# EAGLE design working (EAGLE 6.5.0)
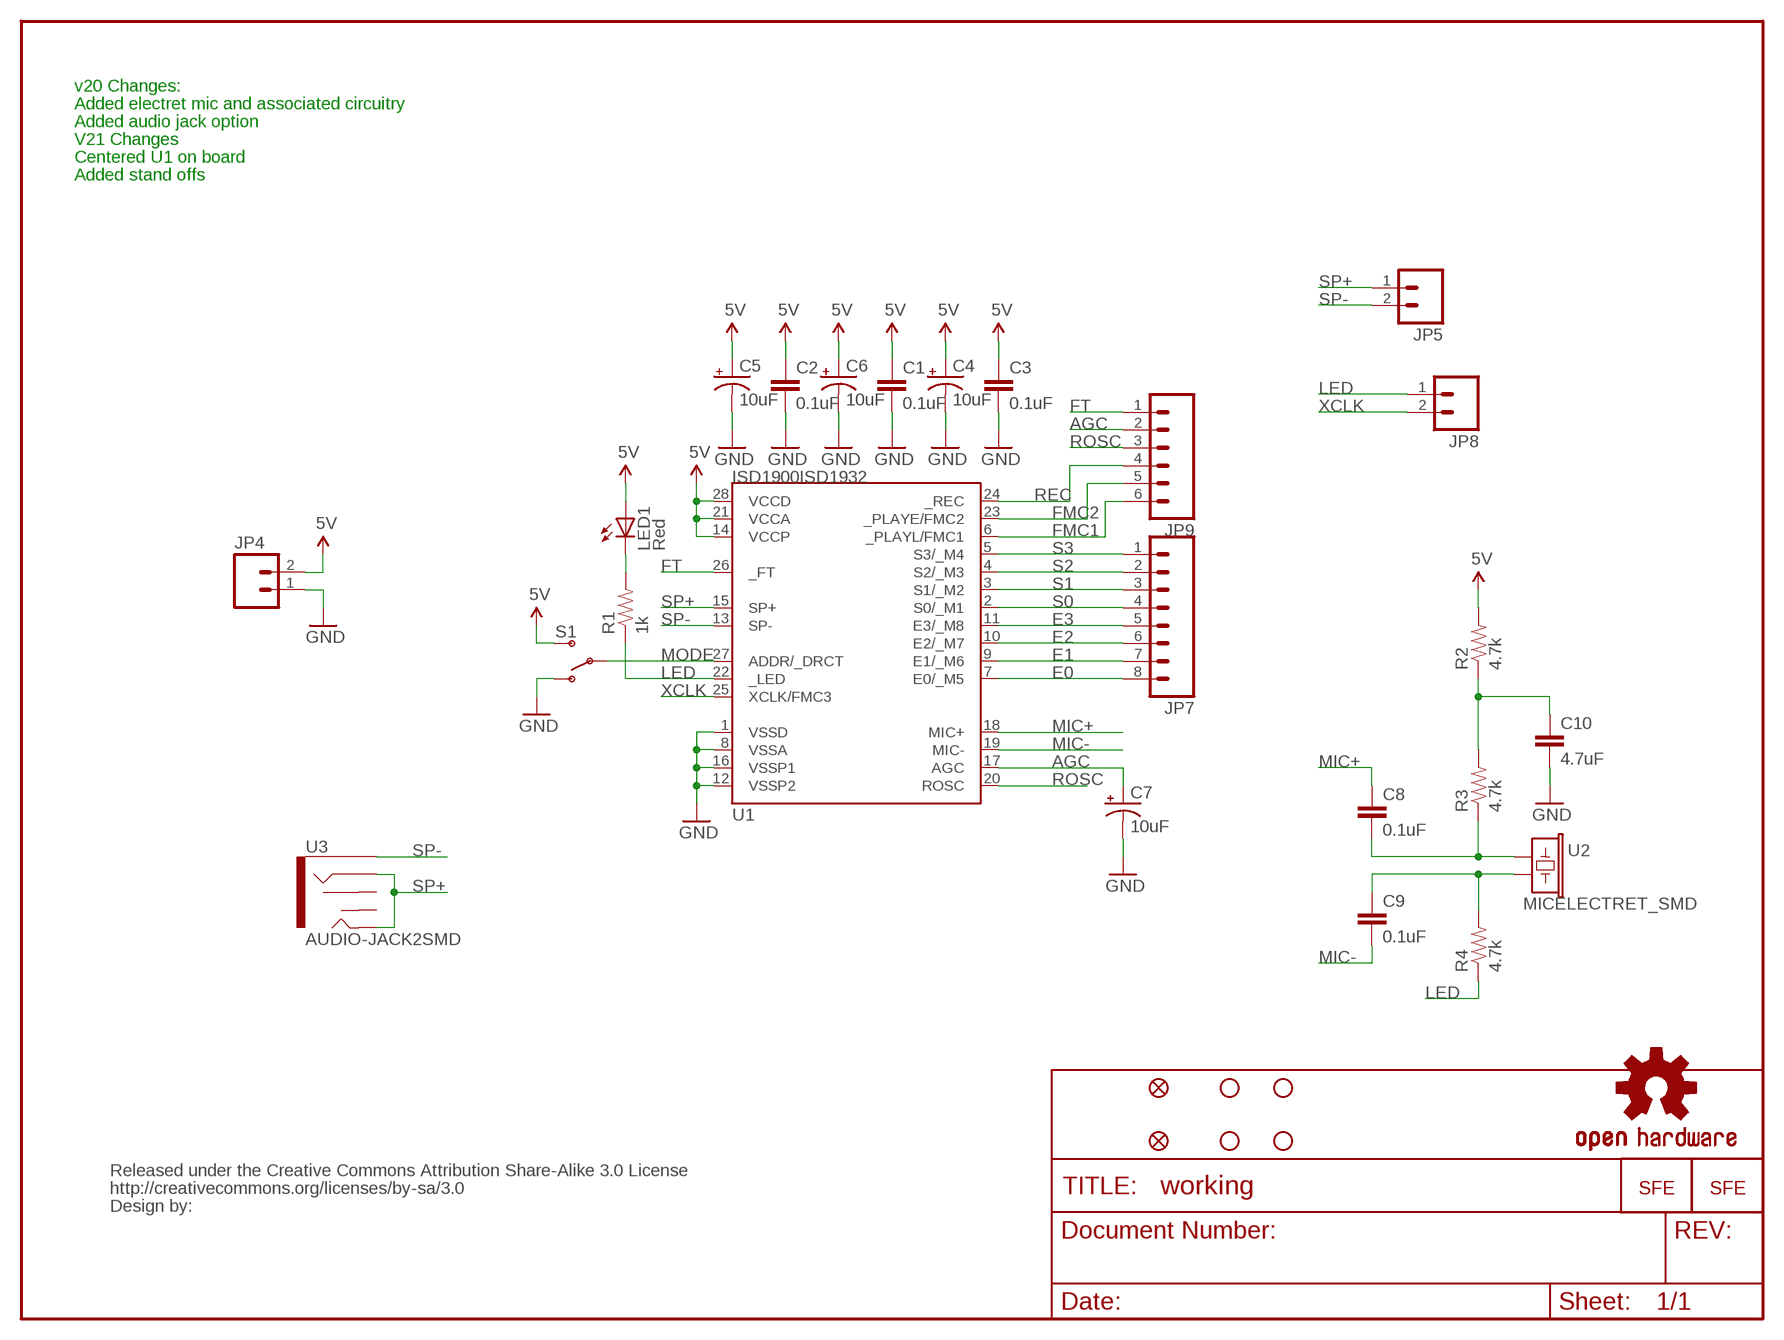
[diagram p0: schematic, sheet 1]

## Parts
C1  0.1uF  CAP0603-CAP  [0603-CAP]
C2  0.1uF  CAP0603-CAP  [0603-CAP]
C3  0.1uF  CAP0603-CAP  [0603-CAP]
C4  10uF  CAP_POL1206  [EIA3216]
C5  10uF  CAP_POL1206  [EIA3216]
C6  10uF  CAP_POL1206  [EIA3216]
C7  10uF  CAP_POL1206  [EIA3216]
C8  0.1uF  CAP0603-CAP  [0603-CAP]
C9  0.1uF  CAP0603-CAP  [0603-CAP]
C10  4.7uF  CAP0603-CAP  [0603-CAP]
JP1  LOGO-SFENEW  [SFE-NEW-WEBLOGO]
JP2  FIDUCIAL1X2  [FIDUCIAL-1X2]
JP3  FIDUCIAL1X2  [FIDUCIAL-1X2]
JP4  M02PTH  [1X02]
JP5  M02PTH  [1X02]
JP6  STAND-OFF  [STAND-OFF]
JP7  M08  [1X08]
JP8  M02PTH  [1X02]
JP9  M06SIP  [1X06]
JP10  STAND-OFF  [STAND-OFF]
JP11  STAND-OFF  [STAND-OFF]
JP12  STAND-OFF  [STAND-OFF]
JP13  LOGO-SFENW2  [SFE-NEW-WEB]
LED1  Red  LED0603  [LED-0603]
R1  1k  RESISTOR0603-RES  [0603-RES]
R2  4.7k  RESISTOR0603-RES  [0603-RES]
R3  4.7k  RESISTOR0603-RES  [0603-RES]
R4  4.7k  RESISTOR0603-RES  [0603-RES]
S1  SWITCH-SPSTSMD  [AYZ0202]
U1  ISD1900ISD1932  [SO-28W]
U2  MICELECTRET_SMD  [MIC_ELECTRET_SMD]
U3  AUDIO-JACK2SMD  [AUDIO-JACK-3.5MM-SMD]
U$10  CREATIVE_COMMONS  [CREATIVE_COMMONS]
U$14  OSHW-LOGOL  [OSHW-LOGO-L]

## Nets
5V: C1.1 C2.1 C3.1 C4.A(+) C5.A(+) C6.A(+) JP4.2 LED1.A R2.2 S1.3(S) U1.14(VCCP) U1.21(VCCA) U1.28(VCCD)
AGC: C7.A(+) JP9.2 U1.17(AGC)
E0: JP7.8 U1.7(E0/_M5)
E1: JP7.7 U1.9(E1/_M6)
E2: JP7.6 U1.10(E2/_M7)
E3: JP7.5 U1.11(E3/_M8)
FMC1: JP9.6 U1.6(_PLAYL/FMC1)
FMC2: JP9.5 U1.23(_PLAYE/FMC2)
FT: JP9.1 U1.26(_FT)
GND: C1.2 C2.2 C3.2 C4.C(-) C5.C(-) C6.C(-) C7.C(-) C10.2 JP4.1 S1.1(O) U1.1(VSSD) U1.8(VSSA) U1.12(VSSP2) U1.16(VSSP1)
LED: JP8.1 R1.1 R4.1 U1.22(_LED)
MIC+: C8.1 U1.18(MIC+)
MIC-: C9.2 U1.19(MIC-)
MODE: S1.2(P) U1.27(ADDR/_DRCT)
N$1: LED1.C R1.2
N$2: C8.2 R3.1 U2.1
N$3: C9.1 R4.2 U2.2
N$6: C10.1 R2.1 R3.2
REC: JP9.4 U1.24(_REC)
ROSC: JP9.3 U1.20(ROSC)
S0: JP7.4 U1.2(S0/_M1)
S1: JP7.3 U1.3(S1/_M2)
S2: JP7.2 U1.4(S2/_M3)
S3: JP7.1 U1.5(S3/_M4)
SP+: JP5.1 U1.15(SP+) U3.RING U3.TIP
SP-: JP5.2 U1.13(SP-) U3.SLEEVE
XCLK: JP8.2 U1.25(XCLK/FMC3)
Unconnected: U3.RSH U3.TSH

## Notes on the sheet
- v20 Changes:
- Added electret mic and associated circuitry
- Added audio jack option
- V21 Changes
- Centered U1 on board
- Added stand offs

## Library data of the parts
C1-C3 C8-C10 = SparkFun:CAP: Capacitor Standard 0603 ceramic capacitor, and 0.1" leaded capacitor.
C4-C7 = SparkFun:CAP_POL: Capacitor Polarized These are standard SMD and PTH capacitors. Normally 10uF, 47uF, and 100uF in electrolytic and tantalum varieties. Always verify the external diameter of the through hole cap, it varies with capacity, voltage, and manufacturer. The EIA devices should be standard.
JP1 JP13 = SparkFun:LOGO-SFE: Spark Fun Electronics PCB Logo This is the standard Spark Fun Electronics PCB logo.
JP2 JP3 = SparkFun:FIDUCIAL: Fiducial Alignment Points Various fiducial points for machine vision alignment.
JP4 JP5 JP8 = SparkFun:M02: Header 2 Standard 2-pin 0.1" header. Use with straight break away headers (SKU : PRT-00116), right angle break away headers (PRT-00553), swiss pins (PRT-00743), machine pins (PRT-00117), and female headers (PRT-00115). Molex polarized connector foot print use with SKU : PRT-08233 with associated crimp pins and housings.
JP6 JP10-JP12 = SparkFun:STAND-OFF: Stand Off This is the mechanical footprint for a #4 phillips button head screw. Use the keepout ring to avoid running the screw head into surrounding components. SKU : PRT-00447
JP7 = SparkFun:M08: Header 8 Standard 8-pin 0.1" header. Use with straight break away headers (SKU : PRT-00116), right angle break away headers (PRT-00553), swiss pins (PRT-00743), machine pins (PRT-00117), and female headers (PRT-00115).
JP9 = SparkFun:M06: Header 6 Standard 6-pin 0.1" header. Use with straight break away headers (SKU : PRT-00116), right angle break away headers (PRT-00553), swiss pins (PRT-00743), machine pins (PRT-00117), and female headers (PRT-00115). Molex polarized connector foot print use with SKU : PRT-08094 with associated crimp pins and housings. NOTES ON THE VARIANTS LOCK and LOCK_LONGPADS... This footprint was designed to help hold the alignment of a through-hole component (i.e. 6-pin header) while soldering it into place. You may notice that each hole has been shifted either up or down by 0.005 of an inch from it's more standard position (which is a perfectly straight line). This slight alteration caused the pins (the squares in the middle) to touch the edges of the holes. Because they are alternating, it causes a "brace" to hold the component in place. 0.005 has proven to be the perfect amount of "off-center" position when using our standard breakaway headers. Although looks a little odd when you look at the bare footprint, once you have a header in there, the alteration is very hard to notice. Also, if you push a header all the way into place, it is covered up entirely on the bottom side. This idea of altering the position of holes to aid alignment will be further integrated into the Sparkfun Library for other footprints. It can help hold any component with 3 or more connection pins.
LED1 = SparkFun:LED: LEDs Standard schematic elements and footprints for 5mm, 3mm, 1206, and 0603 sized LEDs. 5mm - Spark Fun Electronics SKU : COM-00529 (and others)
R1-R4 = SparkFun:RESISTOR: Resistor Basic schematic elements and footprints for 0603, 1206, and PTH resistors.
S1 = SparkFun:SWITCH-SPST: SPST Switch Simple slide switch. Spark Fun Electronics SKU : COM-00102
U1 = SparkFun:ISD1900
U2 = SparkFun:MIC: Microphone Omni-directional electret microphone. 9.7mm standard diameter.
U3 = SparkFun:AUDIO-JACK2
U$10 = SparkFun:CREATIVE_COMMONS
U$14 = SparkFun:OSHW-LOGO: Open Source Hardware Logo This logo indicates the piece of hardware it is found on incorporates a OSHW license and/or adheres to the definition of open source hardware found here: http://freedomdefined.org/OSHW

## Board
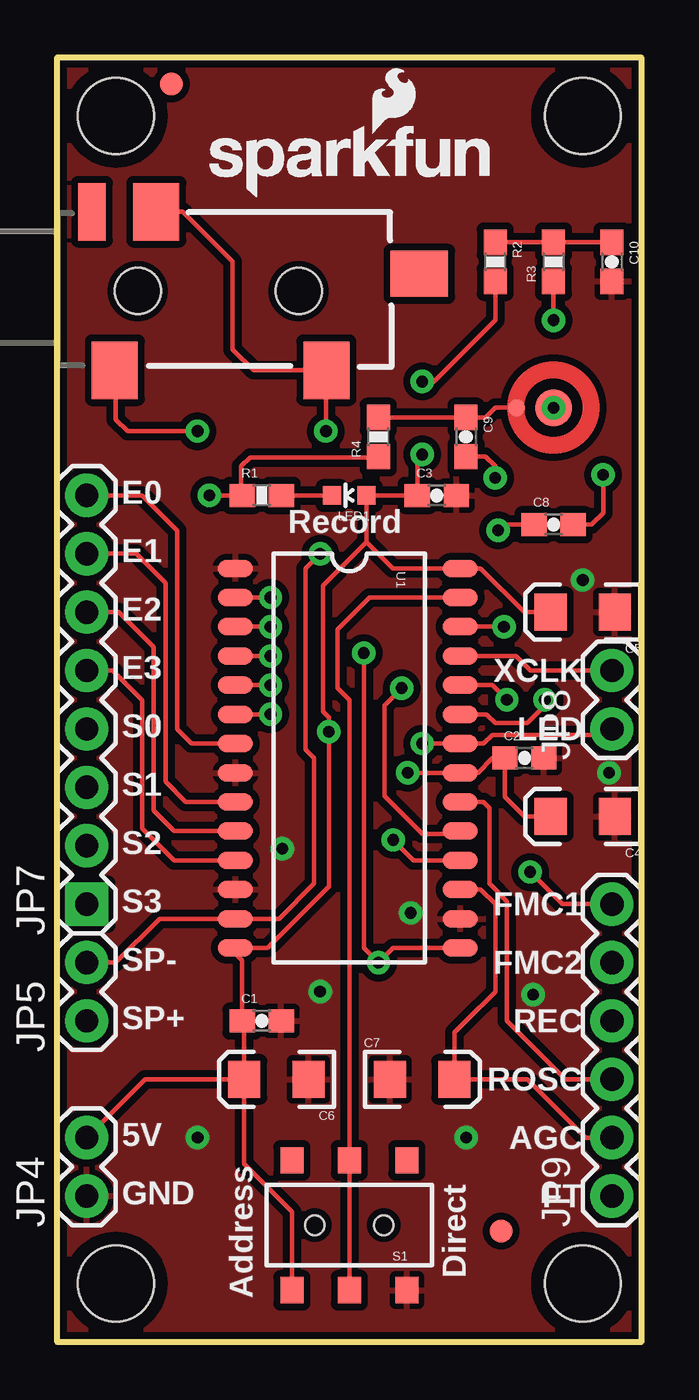
[diagram p1: board, top side]
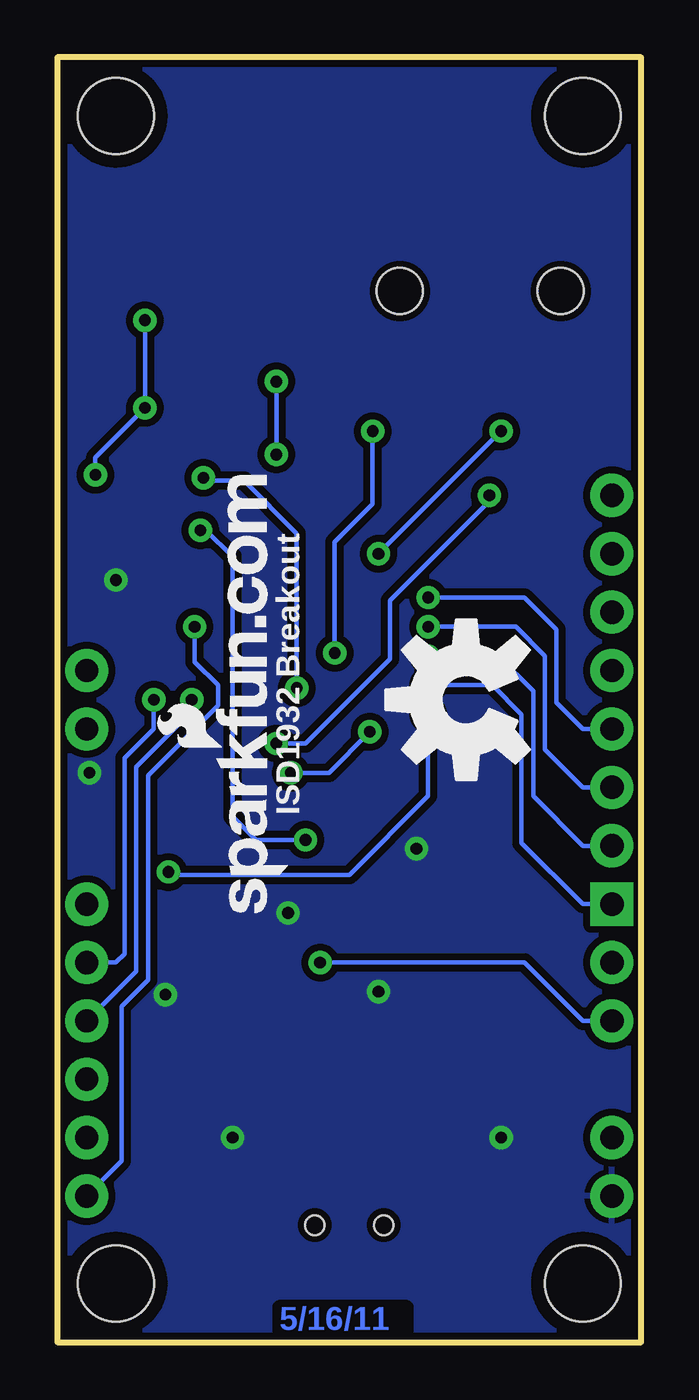
[diagram p2: board, bottom side, seen from below]

Size 25.4 x 55.88 mm. Coordinates in mm from the lower left corner, seen from the top.
Outline: 0,0 0,55.88 25.4,55.88 25.4,0 0,0
Copper layers (1*16): Top 0.035mm / dielectric 1.5mm / Bottom 0.035mm
Design rules "SparkFun": minimum track width 8mil, minimum drill 20mil, track to track 8mil, track to pad 8mil, pad to pad 8mil, via to via 8mil, smd to smd 8mil, copper to edge 10mil, drill to drill 8mil, minimum pad ring 12mil, minimum via ring 10mil, stop-mask expansion 4mil, vias tented up to drill 25mil, thermal gap 10mil

### Footprints (pad centres in the part's own frame; a part is rotated, then mirrored left to right if it is on the bottom)
0603-CAP = smd 1.1 x 1: 1 -0.85,0; 2 0.85,0
EIA3216 = smd 1.4 x 1.6: A 1.4,0; C -1.4,0
FIDUCIAL-1X2 = smd 1 x 1: 1 0,0
1X02 = drill 1.016 pad 1.88: 1 0,0; 2 2.54,0
STAND-OFF = hole 3.302: 0,0
1X08 = drill 1.016 pad 1.88 square: 1 0,0 | drill 1.016 pad 1.88: 2 2.54,0; 3 5.08,0; 4 7.62,0; 5 10.16,0; 6 12.7,0; 7 15.24,0; 8 17.78,0
1X06 = drill 1.016 pad 1.88: 1 0,0; 2 2.54,0; 3 5.08,0; 4 7.62,0; 5 10.16,0; 6 12.7,0
LED-0603 = smd 0.8 x 0.8: A 0,-0.75; C 0,0.75
0603-RES = smd 1.1 x 1: 1 -0.85,0; 2 0.85,0
AYZ0202 = smd 1 x 1.15: 1 -2.5,2.825; 2 0,2.825; 3 2.5,2.825; 4 -2.5,-2.825; 5 0,-2.825; 6 2.5,-2.825 | hole 0.85: 1.5,0; -1.5,0
SO-28W = smd 0.762 x 1.524: 1 -8.255,-4.953; 2 -6.985,-4.953; 3 -5.715,-4.953; 4 -4.445,-4.953; 5 -3.175,-4.953; 6 -1.905,-4.953; 7 -0.635,-4.953; 8 0.635,-4.953; 9 1.905,-4.953; 10 3.175,-4.953; 11 4.445,-4.953; 12 5.715,-4.953; 13 6.985,-4.953; 14 8.255,-4.953; 15 8.255,4.826; 16 6.985,4.826; 17 5.715,4.826; 18 4.445,4.826; 19 3.175,4.826; 20 1.905,4.826; 21 0.635,4.826; 22 -0.635,4.826; 23 -1.905,4.826; 24 -3.175,4.826; 25 -4.445,4.826; 26 -5.715,4.826; 27 -6.985,4.826; 28 -8.255,4.826
MIC_ELECTRET_SMD = smd 1.6 x 1.6: 1 0,0 | smd 0.75 x 0.75: 2 0,1.6
AUDIO-JACK-3.5MM-SMD = smd 2 x 2.5: RING 4.3,3.45; SLEEVE 2.5,-3.45; TIP 11.7,-3.45 | smd 1.2 x 2.5: RSH 1.5,3.45 | smd 2.5 x 2: TSH 15.75,0.75 | hole 2: 3.5,0; 10.5,0

### Placement (x,y rotation side)
C1  8.89,13.97 0 top
C2  20.32,25.4 0 top
C3  16.51,36.83 0 top
C4  22.86,22.86 180 top
C5  22.86,31.75 180 top
C6  9.53,11.43 180 top
C7  15.88,11.43 0 top
C8  21.59,35.56 0 top
C9  17.78,39.37 270 top
C10  24.13,46.99 270 top
JP1  15.37,18.67 90 bottom
JP2  4.95,54.74 0 top
JP3  19.3,4.83 0 top
JP4  1.27,6.35 90 top
JP5  1.27,13.97 90 top
JP6  22.86,53.34 0 top
JP7  1.27,19.05 90 top
JP8  24.13,26.67 90 top
JP9  24.13,6.35 90 top
JP10  2.54,53.34 0 top
JP11  2.54,2.54 0 top
JP12  22.86,2.54 0 top
JP13  6.6,49.78 0 top
LED1  12.7,36.83 90 top
R1  8.89,36.83 0 top
R2  19.05,46.99 270 top
R3  21.59,46.99 90 top
R4  13.97,39.37 90 top
S1  12.7,5.08 180 top
U1  12.7,25.4 270 top
U2  21.59,40.64 90 top
U3  0,45.72 0 top
U$10  2.54,-2.54 0 top
U$13  [SFE-LOGO-FLAME]  13.72,52.58 0 top
U$14  7.62,27.94 90 bottom

### Tracks (layer width: path | path; a pad name or v marks a point on that pad's centre or on a via)
5V  (via drill 0.51)
  Top 0.203: 13.45,34.81 LED1.A C3.1 15.66,38.39 v15.88,38.61 | C2.1 19.05,25.4 | 13.45,34.81 14.61,33.66 U1.28 18.41,33.66 20.32,31.75 C5.A | v15.24,24.77 U1.21 18.29,24.77 18.92,25.4 C2.1 | C6.A 8.12,7.75 10.2,5.67 S1.3 | 13.45,34.81 11.56,32.92 11.56,27.43 11.81,27.18 v11.81,26.54 11.81,19.81 9.14,17.14 U1.14 7.75,16.89 8.04,16.6 C1.1 | C2.1 19.47,23.71 20.32,22.86 C4.A | C6.A 8.12,13.88 | JP4.2 3.81,11.43 C6.A | R2.2 19.05,44.45 16.38,41.78 v15.88,41.78
  Top 0.254: 8.12,13.88 C1.1
  Bottom 0.203: v15.88,38.61 v15.88,41.78 | v15.24,24.77 13.59,24.77 v11.81,26.54
AGC
  Top 0.203: U1.17 18.41,19.68 19.05,19.05 19.05,15.24 17.78,13.97 17.27,13.46 C7.A 20.45,11.43 22.99,8.89 JP9.2
  Top 0.254: C7.A 17.78,11.43
E0
  Top 0.203: JP7.8 3.68,36.83 5.21,35.31 5.21,26.67 5.84,26.04 U1.7 7.11,26.04
E1
  Top 0.203: JP7.7 3.43,34.29 4.7,33.02 4.7,24.38 5.59,23.5 U1.9
E2
  Top 0.203: JP7.6 2.67,31.75 4.19,30.23 4.19,23.11 5.08,22.23 U1.10
E3
  Top 0.203: JP7.5 2.41,29.21 3.68,27.94 3.68,22.35 5.08,20.95 U1.11
FMC1  (via drill 0.51)
  Top 0.203: v9.27,27.3 U1.6 | JP9.6 21.97,19.05 v20.57,20.45
  Bottom 0.203: v9.27,27.3 9.27,23.75 12.7,20.32 20.45,20.32 v20.57,20.45
FMC2  (via drill 0.51)
  Top 0.203: U1.23 18.67,27.3 19.05,26.92 20.45,26.92 21.21,27.69 v21.21,27.94
  Bottom 0.203: JP9.5 22.86,16.51 22.48,16.89 22.48,25.4 21.21,26.67 v21.21,27.94
FT  (via drill 0.51)
  Top 0.203: v19.43,31.11 U1.26
  Bottom 0.203: JP9.1 22.61,7.87 22.61,14.61 21.46,15.75 21.46,24.64 18.41,27.69 18.41,28.57 19.43,29.59 v19.43,31.11
GND  (via drill 0.51)
  other vias: 6.1,8.89 17.78,8.89 15.37,18.67 11.43,15.24 9.78,21.46 24,24.77 20.7,15.11 22.86,33.15
  pour Bottom (isolate 0.305): 0,0 0,55.88 25.4,55.88 25.4,0
  pour Top (isolate 0.305): 0,0 0,55.88 25.4,55.88 25.4,0
LED  (via drill 0.51)
  Top 0.203: v15.88,26.04 U1.22 18.54,26.04 18.92,26.42 23.88,26.42 JP8.1 | v6.6,36.83 R1.1 8,36.87 8,38.1 8.38,38.48 13.93,38.48
  Top 0.254: 13.93,38.48 R4.1
  Bottom 0.203: v15.88,26.04 14.61,26.04 10.92,29.72 10.92,32.26 6.6,36.58 v6.6,36.83
MIC+  (via drill 0.51)
  Top 0.203: U1.18 15.49,20.95 v14.61,21.84 | C8.1 19.43,35.56 v19.18,35.31
  Bottom 0.203: v19.18,35.31 18.92,35.31 17.78,34.16 17.78,22.86 16.76,21.84 v14.61,21.84
MIC-  (via drill 0.51)
  Top 0.203: U1.19 16.89,22.1 15.88,22.1 14.22,23.75 14.22,27.69 v14.99,28.45 | C9.2 18.63,38.52 19.05,38.1 v19.05,37.59
  Bottom 0.203: v14.99,28.45 14.99,35.18 17.27,37.47 18.92,37.47 v19.05,37.59
MODE
  Top 0.203: S1.2 12.7,27.94 12.19,28.45 12.19,30.99 13.59,32.38 U1.27
N$1
  Top 0.203: R1.2 LED1.C
N$2  (via drill 0.51)
  Top 0.203: v21.59,44.45 R3.1 | C8.2 23.24,35.56 23.75,36.07 v23.75,37.72
  Top 0.254: C8.2 22.86,35.56
  Bottom 0.203: v21.59,44.45 U2.1 23.75,38.48 v23.75,37.72
  other vias: 21.59,40.64
N$3
  Top 0.203: R4.2 C9.1 18.63,40.22 19.05,40.64 U2.2
N$6
  Top 0.203: C10.1 R3.2 R2.1
REC  (via drill 0.51)
  Top 0.203: U1.24 18.92,28.57 v19.56,27.94
  Bottom 0.203: v19.56,27.94 19.56,27.43 21.97,25.02 21.97,16.13 JP9.4
ROSC
  Top 0.203: JP9.3 22.1,11.43 19.56,13.97 19.56,19.18 18.8,19.94 18.8,23.24 18.54,23.5 U1.20
S0  (via drill 0.51)
  Top 0.203: v9.27,32.38 U1.2
  Bottom 0.203: v9.27,32.38 5.08,32.38 3.68,30.99 3.68,27.81 2.54,26.67 JP7.4
S1  (via drill 0.51)
  Top 0.203: v9.27,31.11 U1.3
  Bottom 0.203: v9.27,31.11 5.46,31.11 4.19,29.84 4.19,25.78 2.54,24.13 JP7.3
S2  (via drill 0.51)
  Top 0.203: v9.27,29.84 U1.4
  Bottom 0.203: U1.4 7.49,29.84 | U1.4 v9.27,29.84 | JP7.2 2.54,21.59 4.7,23.75 4.7,28.32 6.22,29.84 U1.4
S3  (via drill 0.51)
  Top 0.203: v9.27,28.57 U1.5
  Bottom 0.203: v9.27,28.57 U1.5 6.48,28.57 5.21,27.3 5.21,21.72 2.54,19.05 JP7.1
SP+  (via drill 0.51)
  Top 0.203: U1.15 14.61,17.14 v13.97,16.51 13.34,17.14 v13.34,29.97 | v11.68,39.62 11.68,42.25 U3.TIP | U3.RING 5.44,49.17 7.62,46.99 7.62,43.18 8.53,42.27 U3.TIP | U3.TIP 11.34,41.91
  Bottom 0.203: v13.97,16.51 5.08,16.51 2.54,13.97 JP5.1 | v11.68,39.62 11.68,36.45 13.34,34.8 v13.34,29.97
SP-  (via drill 0.51)
  Top 0.203: JP5.2 2.54,16.51 4.45,18.41 U1.13 9.65,18.41 11.18,19.94 11.18,25.4 10.79,25.78 10.79,33.66 v11.43,34.29 | U3.SLEEVE 2.54,42.23 2.54,40.13 3.05,39.62 v6.1,39.62
  Bottom 0.203: v11.43,34.29 v6.1,39.62
XCLK
  Top 0.203: JP8.2 20.57,29.21 19.94,29.84 U1.25

### Text on the board
Bottom: 5/16/11
tPlace: E0 | Record | E1 | E2 | XCLK | E3 | LED | S0 | S1 | S2 | FMC1 | S3 | FMC2 | SP- | SP+ | REC | ROSC | 5V | AGC | FT | GND | Direct | Address
bPlace: ISD1932 Breakout